# Altium project RC_Transmitter.PrjPcb
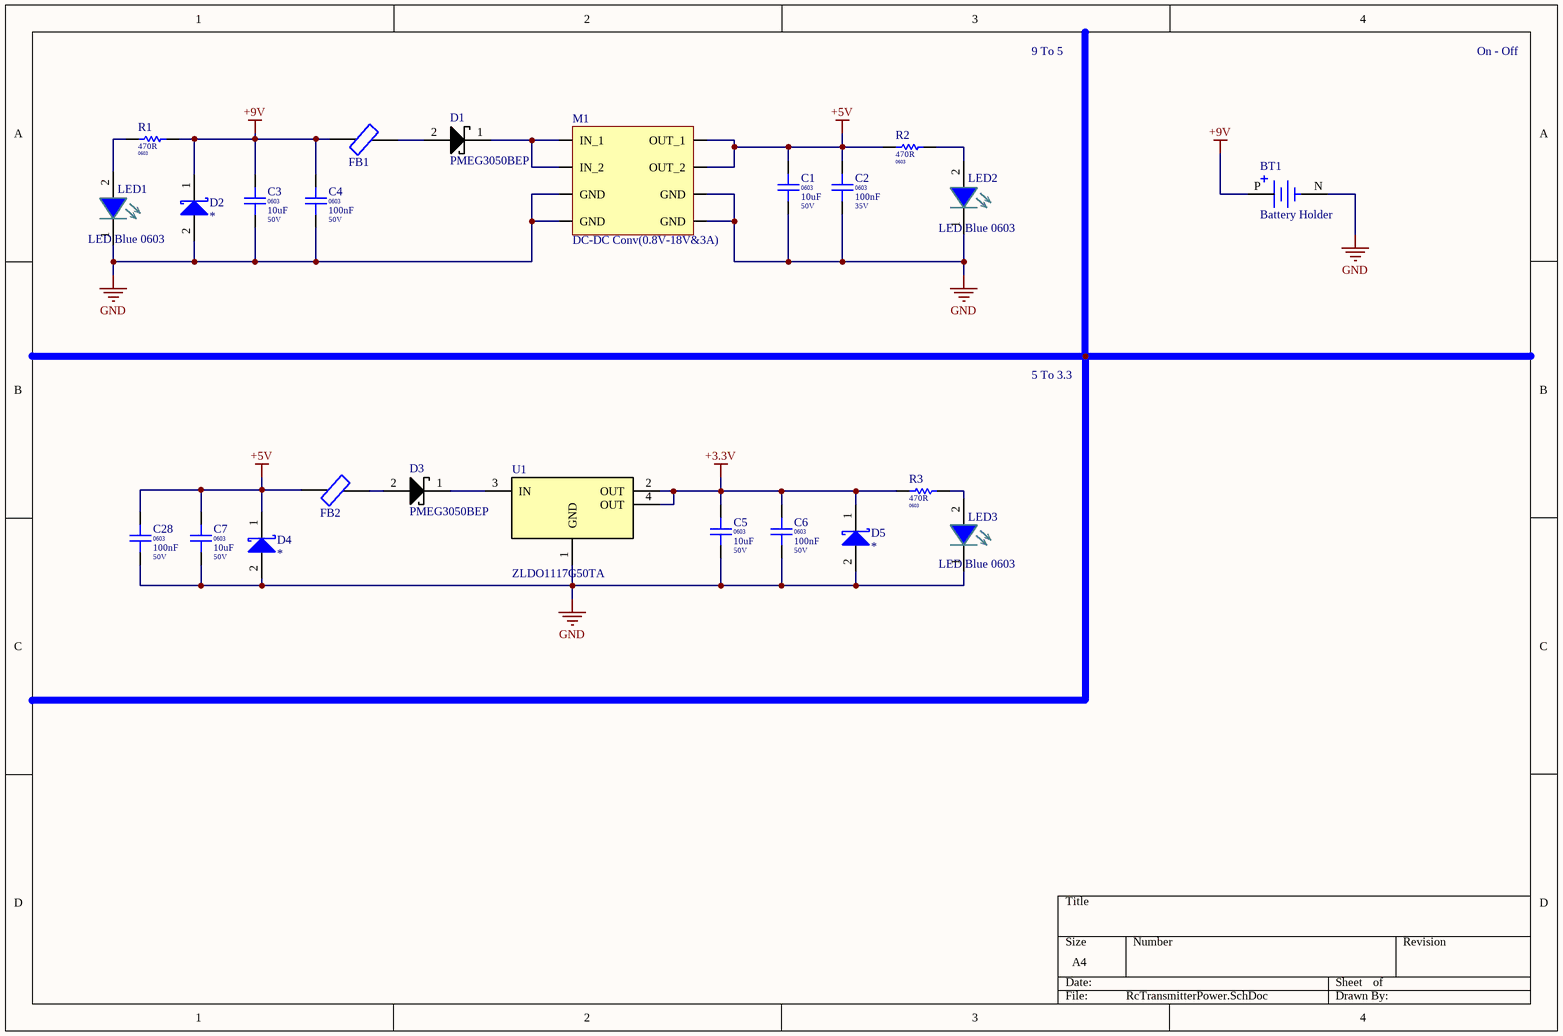
[diagram p0: RcTransmitterPower.SchDoc]
3 sheets, 99 parts. Net scope: flat (ports and power ports of the same name join across sheets).
Board file: RcTransmitter.PcbDoc
Sheets:
  RcTransmitterPower.SchDoc
  RcTransmitterMC.SchDoc
  RcTransmitterSwitches.SchDoc

## Sheet RcTransmitterPower.SchDoc
size A4; SheetNumber: 1; SheetTotal: 3

### Parts
BT1  Battery Holder  [BAT_BC9VPC]
C1  Package / Case: 0603  Voltage: 50V  [CAPC 0603]  (hidden comment: 10uF)
C2  Package / Case: 0603  Voltage: 35V  [CAPC 0603]  (hidden comment: 100nF)
C3  Package / Case: 0603  Voltage: 50V  [CAPC 0603]  (hidden comment: 10uF)
C4  Package / Case: 0603  Voltage: 50V  [CAPC 0603]  (hidden comment: 100nF)
C5  Package / Case: 0603  Voltage: 50V  [CAPC 0603]  (hidden comment: 10uF)
C6  Package / Case: 0603  Voltage: 50V  [CAPC 0603]  (hidden comment: 100nF)
C7  Package / Case: 0603  Voltage: 50V  [CAPC 0603]  (hidden comment: 10uF)
C28  Package / Case: 0603  Voltage: 50V  [CAPC 0603]  (hidden comment: 100nF)
D1  PMEG3050BEP  [SOD470X100-2N]
D2  *  [DO-214AC, SMA]
D3  PMEG3050BEP  [SOD470X100-2N]
D4  *  [DO-214AC, SMA]
D5  *  [DO-214AC, SMA]
FB1  Ferrite Bead  [FCM1608KF-601T03]  (value not drawn)
FB2  Ferrite Bead  [FCM1608KF-601T03]  (value not drawn)
LED1  LED Blue 0603  [LED BLUE 0603]
LED2  LED Blue 0603  [LED BLUE 0603]
LED3  LED Blue 0603  [LED BLUE 0603]
M1  DC-DC Conv(0.8V-18V&3A)  [mp]
R1  Package / Case: 0603  [RESC 0603]  (hidden comment: 470R)
R2  Package / Case: 0603  [RESC 0603]  (hidden comment: 470R)
R3  Package / Case: 0603  [RESC 0603]  (hidden comment: 470R)
U1  ZLDO1117G50TA  [1117]

### Nets
+3.3V: C5.2 C6.2 D5.1(K) R3.2 U1.2(OUT) U1.4(OUT)
+5V: C1.2 C2.2 C7.2 C28.2 D4.1(K) FB2.1 M1.3(OUT_1) M1.4(OUT_2) R2.2
+9V: BT1.P(POS) C3.2 C4.2 D2.1(K) FB1.1 R1.1
GND: BT1.N(NEG) C1.1 C2.1 C3.1 C4.1 C5.1 C6.1 C7.1 C28.1 D2.2(A) D4.2(A) D5.2(A) LED1.1 LED2.1 LED3.1 M1.5(GND) M1.6(GND) M1.7(GND) M1.8(GND) U1.1(GND)
NetD1_1: D1.1(K) M1.1(IN_1) M1.2(IN_2)
NetD1_2: D1.2(A) FB1.2
NetD3_1: D3.1(K) U1.3(IN)
NetD3_2: D3.2(A) FB2.2
NetLED1_2: LED1.2 R1.2
NetLED2_2: LED2.2 R2.1
NetLED3_2: LED3.2 R3.1

### Notes on the sheet
- 9 To 5
- On - Off
- 5 To 3.3

### Library data of the parts
BT1 = Battery Holder: BATTERY HOLDER 9V PC PIN; MF: MPD; MP: BC9VPC; Check_prices: https://www.snapeda.com/parts/BC9VPC/MPD/view-part/4389071/?ref=eda; Package: None; Value: *; Price: None; Availability: Warning; SnapEDA_Link: https://www.snapeda.com/parts/BC9VPC/MPD/view-part/4389071/?ref=snap; Purchase-URL: https://pricing.snapeda.com/search/part/BC9VPC/?ref=eda
C1 C3 C5 C7 = CAPC0301: Capacitor Ceramic 10uF 50V 0603; Tolerance: %10; Value Rating: uF; Value: 10uF; Part Number: CAPC0301; Category: Capacitor Ceramic; Values: 10uF 50V
C2 = CAPC0328: Capacitor Ceramic 100nF 35V 0603; Tolerance: %10; Value Rating: nF; Value: 100nF; Part Number: CAPC0328; Category: Capacitor Ceramic; Values: 100nF 35V
C4 C6 C28 = CAPC0285: Capacitor Ceramic 100nF 50V 0603; Tolerance: %10; Value Rating: nF; Favorites: Favorite; Value: 100nF; Part Number: CAPC0285; Category: Capacitor Ceramic; Values: 100nF 50V
D1 D3 = Schotky Diode: Manufacturer: Nexperia USA; Manufacturer Part Number: PMEG3050BEP,115; Supplier 1: Digi-Key; Supplier Part Number 1: 1727-5207-1-ND; Stock 1: 62590; Pricing 1: 1=0.44, 10=0.373, 100=0.2786, 500=0.2189, 1000=0.1692 (USD)
D2 D4 D5 = Diode0012: Values: FILL!!!; Diode Type: Schottky; Manufacturer Part Number: *; Part Number: Diode0012; Category: Diode Schottky; Package / Case: DO-214AC, SMA; Voltage - DC Reverse (Vr): FILL!!!; Voltage - Forward (Vf): FILL!!!; Current: FILL!!!; Speed: FILL!!!
FB1 FB2 = FCM1608KF-601T03
M1 = MP1584EN
R1-R3 = R0188: 470R 0603; Part Number: R0188; Tolerance: %5; Power: 1/10W; Value: 470R; Category: Resistor; Values: 470R
U1 = ZLDO1117G50TA: IC REG LDO 5V 1A SOT223

## Sheet RcTransmitterMC.SchDoc
size 297 x 203 mm; SheetNumber: 2; SheetTotal: 3
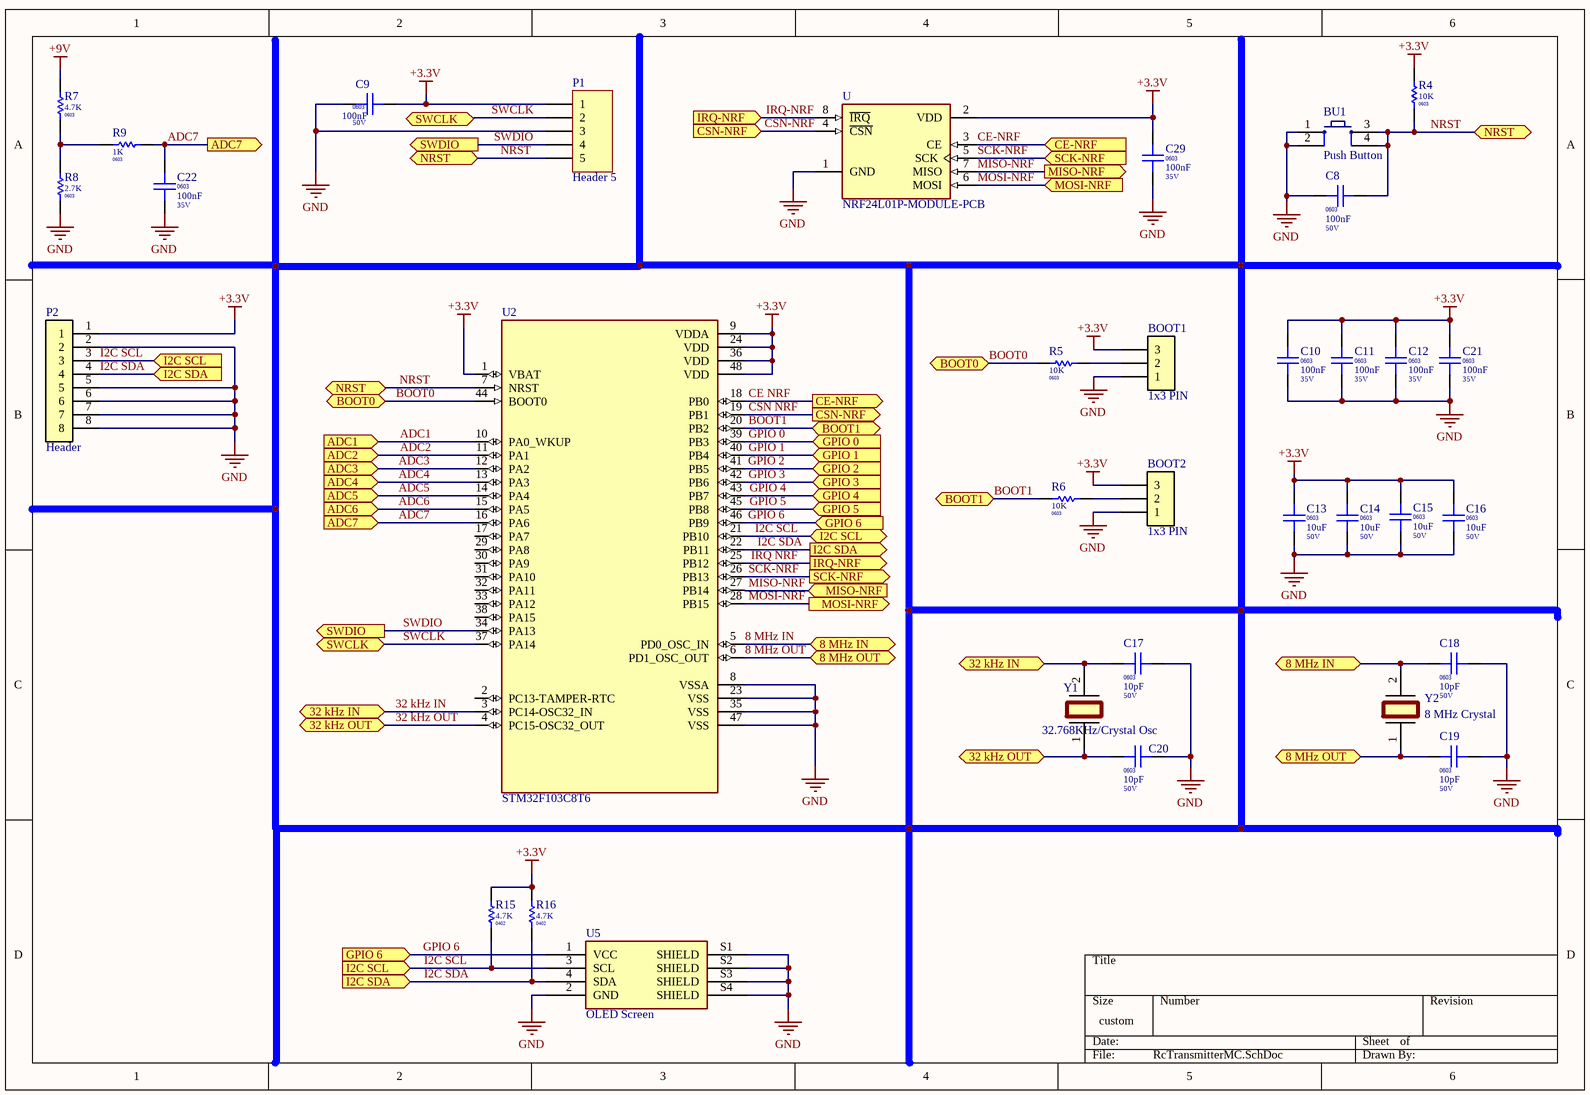
[diagram p1: RcTransmitterMC.SchDoc]

### Parts
BOOT1  1x3 PIN  [HDR_2.54_1X3]
BOOT2  1x3 PIN  [HDR_2.54_1X3]
BU1  Push Button  [button son]
C8  Package / Case: 0603  Voltage: 50V  [CAPC 0603]  (hidden comment: 100nF)
C9  Package / Case: 0603  Voltage: 50V  [CAPC 0603]  (hidden comment: 100nF)
C10  Package / Case: 0603  Voltage: 35V  [CAPC 0603]  (hidden comment: 100nF)
C11  Package / Case: 0603  Voltage: 35V  [CAPC 0603]  (hidden comment: 100nF)
C12  Package / Case: 0603  Voltage: 35V  [CAPC 0603]  (hidden comment: 100nF)
C13  Package / Case: 0603  Voltage: 50V  [CAPC 0603]  (hidden comment: 10uF)
C14  Package / Case: 0603  Voltage: 50V  [CAPC 0603]  (hidden comment: 10uF)
C15  Package / Case: 0603  Voltage: 50V  [CAPC 0603]  (hidden comment: 10uF)
C16  Package / Case: 0603  Voltage: 50V  [CAPC 0603]  (hidden comment: 10uF)
C17  Package / Case: 0603  Voltage: 50V  [CAPC 0603]  (hidden comment: 10pF)
C18  Package / Case: 0603  Voltage: 50V  [CAPC 0603]  (hidden comment: 10pF)
C19  Package / Case: 0603  Voltage: 50V  [CAPC 0603]  (hidden comment: 10pF)
C20  Package / Case: 0603  Voltage: 50V  [CAPC 0603]  (hidden comment: 10pF)
C21  Package / Case: 0603  Voltage: 35V  [CAPC 0603]  (hidden comment: 100nF)
C22  Package / Case: 0603  Voltage: 35V  [CAPC 0603]  (hidden comment: 100nF)
C29  Package / Case: 0603  Voltage: 35V  [CAPC 0603]  (hidden comment: 100nF)
P1  Header 5  [HDR1X5]
P2  Header  [IMU_HEADER]
R4  Package / Case: 0603  [RESC 0603]  (hidden comment: 10K)
R5  Package / Case: 0603  [RESC 0603]  (hidden comment: 10K)
R6  Package / Case: 0603  [RESC 0603]  (hidden comment: 10K)
R7  Package / Case: 0603  [RESC 0603]  (hidden comment: 4.7K)
R8  Package / Case: 0603  [RESC 0603]  (hidden comment: 2.7K)
R9  Package / Case: 0603  [RESC 0603]  (hidden comment: 1K)
R15  Package / Case: 0402  [RESC 0402]  (hidden comment: 4.7K)
R16  Package / Case: 0402  [RESC 0402]  (hidden comment: 4.7K)
U  NRF24L01P-MODULE-PCB  [nrf]
U2  STM32F103C8T6  [QFP50P900X900X160-48N]
U5  OLED Screen  [SSD1106 OLED]
Y1  32.768KHz/Crystal Osc  [32KhZ crystal oscillator]
Y2  8 MHz Crystal  [XTAL_HC49P488W43L1085T450H368]

### Ports
8 MHz IN (bidir), 8 MHz OUT (bidir), 32 kHz IN (bidir), 32 kHz OUT (bidir), ADC1 (in), ADC2 (in), ADC3 (in), ADC4 (in), ADC5 (in), ADC6 (in), ADC7 (in), ADC7 (out), BOOT0 (bidir), BOOT1 (bidir), CE-NRF (in), CE-NRF (out), CSN-NRF (in), CSN-NRF (out), GPIO 0 (in), GPIO 1 (in), GPIO 2 (in), GPIO 3 (in), GPIO 4 (in), GPIO 5 (in), GPIO 6 (in), I2C SCL (bidir), I2C SCL (in), I2C SDA (in), I2C SDA (out), IRQ-NRF (in), IRQ-NRF (out), MISO-NRF (in), MISO-NRF (out), MOSI-NRF (in), MOSI-NRF (out), NRST (bidir), SCK-NRF (in), SCK-NRF (out), SWCLK (bidir), SWDIO (out)

### Nets
+3.3V: BOOT1.3 BOOT2.3 C9.2 C10.2 C11.2 C12.2 C13.2 C14.2 C15.2 C16.2 C21.2 C29.2 P1.1 P2.1 R4.2 R15.2 R16.2 U.2(VDD) U2.1(VBAT) U2.9(VDDA) U2.24(VDD) U2.36(VDD) U2.48(VDD)
+9V: R7.2
GND: BOOT1.1 BOOT2.1 BU1.1 BU1.2 C8.1 C9.1 C10.1 C11.1 C12.1 C13.1 C14.1 C15.1 C16.1 C17.2 C18.2 C19.2 C20.2 C21.1 C22.1 C29.1 P1.3 P2.2 P2.5 P2.6 P2.7 P2.8 R8.1 U.1(GND) U2.8(VSSA) U2.23(VSS) U2.35(VSS) U2.47(VSS) U5.2(GND) U5.S1(SHIELD) U5.S2(SHIELD) U5.S3(SHIELD) U5.S4(SHIELD)
8 MHz IN: C18.1 U2.5(PD0_OSC_IN) Y2.2 ; port 8 MHz IN
8 MHz OUT: C19.1 U2.6(PD1_OSC_OUT) Y2.1 ; port 8 MHz OUT
32 kHz IN: C17.1 U2.3(PC14-OSC32_IN) Y1.2 ; port 32 kHz IN
32 kHz OUT: C20.1 U2.4(PC15-OSC32_OUT) Y1.1 ; port 32 kHz OUT
ADC1: U2.10(PA0_WKUP) ; port ADC1
ADC2: U2.11(PA1) ; port ADC2
ADC3: U2.12(PA2) ; port ADC3
ADC4: U2.13(PA3) ; port ADC4
ADC5: U2.14(PA4) ; port ADC5
ADC6: U2.15(PA5) ; port ADC6
ADC7: C22.2 R9.2 U2.16(PA6) ; port ADC7
BOOT0: R5.1 U2.44(BOOT0) ; port BOOT0
BOOT1: R6.1 U2.20(PB2) ; port BOOT1
CE NRF: U.3(CE) U2.18(PB0) ; port CE-NRF  [also labelled CE-NRF]
CSN NRF: U.4(~{CSN}) U2.19(PB1) ; port CSN-NRF  [also labelled CSN-NRF]
GPIO 0: U2.39(PB3) ; port GPIO 0
GPIO 1: U2.40(PB4) ; port GPIO 1
GPIO 2: U2.41(PB5) ; port GPIO 2
GPIO 3: U2.42(PB6) ; port GPIO 3
GPIO 4: U2.43(PB7) ; port GPIO 4
GPIO 5: U2.45(PB8) ; port GPIO 5
GPIO 6: U2.46(PB9) U5.1(VCC) ; port GPIO 6
I2C SCL: P2.3 R15.1 U2.21(PB10) U5.3(SCL) ; port I2C SCL
I2C SDA: P2.4 R16.1 U2.22(PB11) U5.4(SDA) ; port I2C SDA
IRQ NRF: U.8(~{IRQ}) U2.25(PB12) ; port IRQ-NRF  [also labelled IRQ-NRF]
MISO-NRF: U.7(MISO) U2.27(PB14) ; port MISO-NRF
MOSI-NRF: U.6(MOSI) U2.28(PB15) ; port MOSI-NRF
NRST: BU1.3 BU1.4 C8.2 P1.5 R4.1 U2.7(NRST) ; port NRST
SCK-NRF: U.5(SCK) U2.26(PB13) ; port SCK-NRF
SWCLK: P1.2 U2.37(PA14) ; port SWCLK
SWDIO: P1.4 U2.34(PA13) ; port SWDIO
NetBOOT1_2: BOOT1.2 R5.2
NetBOOT2_2: BOOT2.2 R6.2
NetR7_1: R7.1 R8.2 R9.1

Not connected (* = marked no-connect by the designer): U2 2(PC13-TAMPER-RTC) 17(PA7) 29(PA8) 30(PA9) 31(PA10) 32(PA11) 33(PA12) 38(PA15)

### Library data of the parts
BOOT1 BOOT2 = Connector0009: Header 2.54 1x3; Part Number: Connector0009; Category: Connectors; Package / Case: HDR_2.54_1X3; Values: Header 2.54 1x3
BU1 = Push Button: Smd Push Button; Satın Alma Linki: https://urun.n11.com/diger/mini-pushbutton-switch-smd-P227461537?gclid=Cj0KCQjwkoDmBRCcARIsAG3xzl8Y_-jeD7HocNM6lvuZ_rVp83568XPGtNzlPwXWLph8oCRqo0yh87UaApZYEALw_wcB&gclsrc=aw.ds
C8 C9 = CAPC0285: as C4 on sheet RcTransmitterPower; Value: 100nF; Part Number: CAPC0285; Category: Capacitor Ceramic; Values: 100nF 50V
C10-C12 C21 C22 C29 = CAPC0328: as C2 on sheet RcTransmitterPower; Value: 100nF; Part Number: CAPC0328; Category: Capacitor Ceramic; Values: 100nF 35V
C13-C16 = CAPC0301: as C1 on sheet RcTransmitterPower; Value: 10uF; Part Number: CAPC0301; Category: Capacitor Ceramic; Values: 10uF 50V
C17-C20 = CAPC0242: Capacitor Ceramic 10pF 50V 0603; Tolerance: %10; Value Rating: pF; Value: 10pF; Part Number: CAPC0242; Category: Capacitor Ceramic; Values: 10pF 50V
P1 = Header 5: Header, 5-Pin; LatestRevisionDate: 17-Jul-2002; LatestRevisionNote: Re-released for DXP Platform.; Publisher: Altium Limited
P2 = IMU_HEADER: 1x8
R4-R6 = R0220: 10K 0603; Part Number: R0220; Tolerance: %5; Power: 1/10W; Value: 10K; Category: Resistor; Values: 10K
R7 = R0212: 4.7K 0603; Part Number: R0212; Tolerance: %5; Power: 1/10W; Value: 4.7K; Category: Resistor; Values: 4.7K
R8 = R0206: 2.7K 0603; Part Number: R0206; Tolerance: %5; Power: 1/10W; Value: 2.7K; Category: Resistor; Values: 2.7K
R9 = R0196: 1K 0603; Part Number: R0196; Tolerance: %5; Power: 1/10W; Value: 1K; Category: Resistor; Values: 1K
R15 R16 = R0066: 4.7K 0402; Part Number: R0066; Tolerance: %5; Power: 1/10W; Value: 4.7K; Category: Resistor; Values: 4.7K
U = NRF24L01P-MODULE-PCB: - Transceiver For Use With nRF24L01+; MF: Nordic Semiconductor; Package: None; MP: NRF24L01P-MODULE-PCB; Value: *; Availability: Bad; Price: None; SnapEDA_Link: https://www.snapeda.com/parts/NRF24L01P-MODULE-PCB/Nordic%20Semiconductor%20ASA/view-part/230534/?ref=snap; Mouser-Purchase-URL: https://snapeda.com/shop?store=Mouser&id=230534
U2 = STM32F103C8T6: ARMÂ® CortexÂ®-M3 STM32F1 Microcontroller IC 32-Bit 72MHz 64KB _64K x 8_ FLASH; MF: STMicroelectronics; Price: None; Package: LQFP-48 STMicroelectronics; Value: *; MP: STM32F103C8T6; Availability: Unavailable; SnapEDA_Link: https://www.snapeda.com/parts/STM32F103C8T6/STMicroelectronics/view-part/52195/?ref=snap
U5 = SSD1106 OLED
Y1 = NX3215SA-32.768KHZ-EXS00A-MU00525: Crystal or Oscillator; ComponentLink1Description: New link; ComponentLink1URL: *
Y2 = XTAL_HC49P488W43L1085T450H368

## Sheet RcTransmitterSwitches.SchDoc
size A4; SheetNumber: 3; SheetTotal: 3
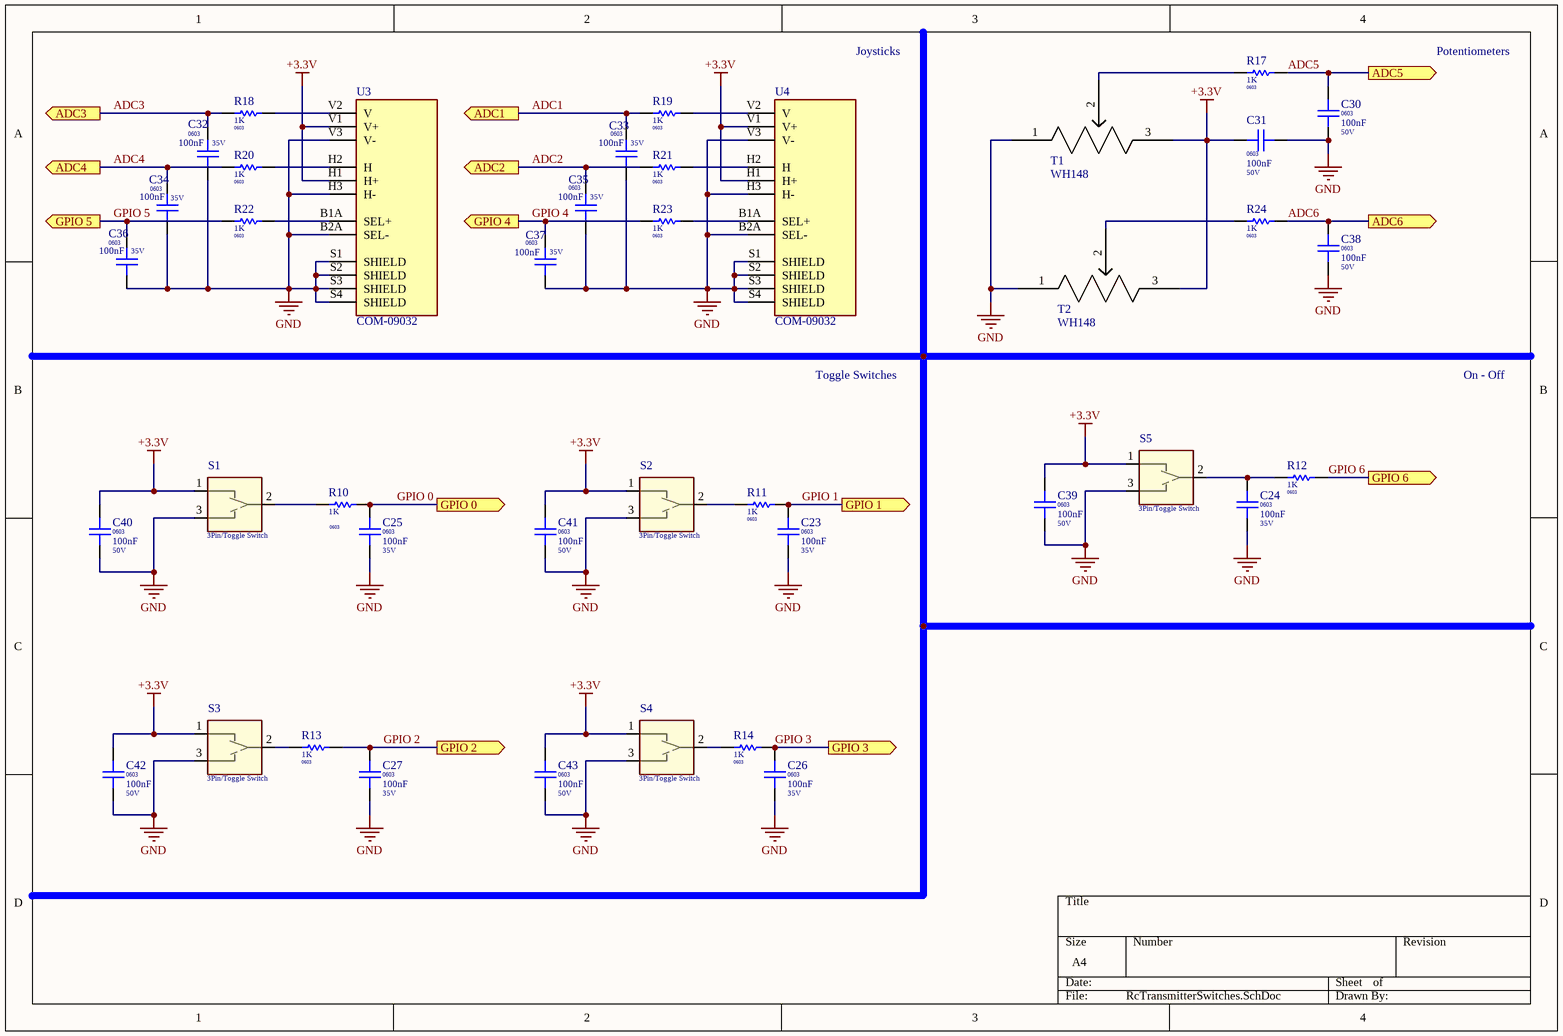
[diagram p2: RcTransmitterSwitches.SchDoc]

### Parts
C23  Package / Case: 0603  Voltage: 35V  [CAPC 0603]  (hidden comment: 100nF)
C24  Package / Case: 0603  Voltage: 35V  [CAPC 0603]  (hidden comment: 100nF)
C25  Package / Case: 0603  Voltage: 35V  [CAPC 0603]  (hidden comment: 100nF)
C26  Package / Case: 0603  Voltage: 35V  [CAPC 0603]  (hidden comment: 100nF)
C27  Package / Case: 0603  Voltage: 35V  [CAPC 0603]  (hidden comment: 100nF)
C30  Package / Case: 0603  Voltage: 50V  [CAPC 0603]  (hidden comment: 100nF)
C31  Package / Case: 0603  Voltage: 50V  [CAPC 0603]  (hidden comment: 100nF)
C32  Package / Case: 0603  Voltage: 35V  [CAPC 0603]  (hidden comment: 100nF)
C33  Package / Case: 0603  Voltage: 35V  [CAPC 0603]  (hidden comment: 100nF)
C34  Package / Case: 0603  Voltage: 35V  [CAPC 0603]  (hidden comment: 100nF)
C35  Package / Case: 0603  Voltage: 35V  [CAPC 0603]  (hidden comment: 100nF)
C36  Package / Case: 0603  Voltage: 35V  [CAPC 0603]  (hidden comment: 100nF)
C37  Package / Case: 0603  Voltage: 35V  [CAPC 0603]  (hidden comment: 100nF)
C38  Package / Case: 0603  Voltage: 50V  [CAPC 0603]  (hidden comment: 100nF)
C39  Package / Case: 0603  Voltage: 50V  [CAPC 0603]  (hidden comment: 100nF)
C40  Package / Case: 0603  Voltage: 50V  [CAPC 0603]  (hidden comment: 100nF)
C41  Package / Case: 0603  Voltage: 50V  [CAPC 0603]  (hidden comment: 100nF)
C42  Package / Case: 0603  Voltage: 50V  [CAPC 0603]  (hidden comment: 100nF)
C43  Package / Case: 0603  Voltage: 50V  [CAPC 0603]  (hidden comment: 100nF)
R10  Package / Case: 0603  [RESC 0603]  (hidden comment: 1K)
R11  Package / Case: 0603  [RESC 0603]  (hidden comment: 1K)
R12  Package / Case: 0603  [RESC 0603]  (hidden comment: 1K)
R13  Package / Case: 0603  [RESC 0603]  (hidden comment: 1K)
R14  Package / Case: 0603  [RESC 0603]  (hidden comment: 1K)
R17  Package / Case: 0603  [RESC 0603]  (hidden comment: 1K)
R18  Package / Case: 0603  [RESC 0603]  (hidden comment: 1K)
R19  Package / Case: 0603  [RESC 0603]  (hidden comment: 1K)
R20  Package / Case: 0603  [RESC 0603]  (hidden comment: 1K)
R21  Package / Case: 0603  [RESC 0603]  (hidden comment: 1K)
R22  Package / Case: 0603  [RESC 0603]  (hidden comment: 1K)
R23  Package / Case: 0603  [RESC 0603]  (hidden comment: 1K)
R24  Package / Case: 0603  [RESC 0603]  (hidden comment: 1K)
S1  3Pin/Toggle Switch  [3Pin/Toggle Switch]
S2  3Pin/Toggle Switch  [3Pin/Toggle Switch]
S3  3Pin/Toggle Switch  [3Pin/Toggle Switch]
S4  3Pin/Toggle Switch  [3Pin/Toggle Switch]
S5  3Pin/Toggle Switch  [3Pin/Toggle Switch]
T1  WH148  [WH148]
T2  WH148  [WH148]
U3  COM-09032  [XDCR_COM-09032]
U4  COM-09032  [XDCR_COM-09032]

### Ports
ADC1 (out), ADC2 (out), ADC3 (out), ADC4 (out), ADC5 (out), ADC6 (out), GPIO 0 (out), GPIO 1 (out), GPIO 2 (out), GPIO 3 (out), GPIO 4 (out), GPIO 5 (out), GPIO 6 (out)

### Nets
+3.3V: C31.2 C39.2 C40.2 C41.2 C42.2 C43.2 S1.1 S2.1 S3.1 S4.1 S5.1 T1.3 T2.3 U3.H1(H+) U3.V1(V+) U4.H1(H+) U4.V1(V+)
GND: C23.1 C24.1 C25.1 C26.1 C27.1 C30.2 C31.1 C32.1 C33.1 C34.1 C35.1 C36.1 C37.1 C38.2 C39.1 C40.1 C41.1 C42.1 C43.1 S1.3 S2.3 S3.3 S4.3 S5.3 T1.1 T2.1 U3.B2A(SEL-) U3.H3(H-) U3.S1(SHIELD) U3.S2(SHIELD) U3.S3(SHIELD) U3.S4(SHIELD) U3.V3(V-) U4.B2A(SEL-) U4.H3(H-) U4.S1(SHIELD) U4.S2(SHIELD) U4.S3(SHIELD) U4.S4(SHIELD) U4.V3(V-)
ADC1: C33.2 R19.1 ; port ADC1
ADC2: C35.2 R21.1 ; port ADC2
ADC3: C32.2 R18.1 ; port ADC3
ADC4: C34.2 R20.1 ; port ADC4
ADC5: C30.1 R17.2 ; port ADC5
ADC6: C38.1 R24.2 ; port ADC6
GPIO 0: C25.2 R10.2 ; port GPIO 0
GPIO 1: C23.2 R11.2 ; port GPIO 1
GPIO 2: C27.2 R13.2 ; port GPIO 2
GPIO 3: C26.2 R14.1 ; port GPIO 3
GPIO 4: C37.2 R23.1 ; port GPIO 4
GPIO 5: C36.2 R22.1 ; port GPIO 5
GPIO 6: R12.2 ; port GPIO 6
NetC24_2: C24.2 R12.1 S5.2
NetR10_1: R10.1 S1.2
NetR11_1: R11.1 S2.2
NetR13_1: R13.1 S3.2
NetR14_2: R14.2 S4.2
NetR17_1: R17.1 T1.2
NetR18_2: R18.2 U3.V2(V)
NetR19_2: R19.2 U4.V2(V)
NetR20_2: R20.2 U3.H2(H)
NetR21_2: R21.2 U4.H2(H)
NetR22_2: R22.2 U3.B1A(SEL+)
NetR23_2: R23.2 U4.B1A(SEL+)
NetR24_1: R24.1 T2.2

### Notes on the sheet
- Joysticks
- Potentiometers
- Toggle Switches
- On - Off

### Library data of the parts
C23-C27 C32-C37 = CAPC0328: as C2 on sheet RcTransmitterPower; Value: 100nF; Part Number: CAPC0328; Category: Capacitor Ceramic; Values: 100nF 35V
C30 C31 C38-C43 = CAPC0285: as C4 on sheet RcTransmitterPower; Value: 100nF; Part Number: CAPC0285; Category: Capacitor Ceramic; Values: 100nF 50V
R10-R14 R17-R24 = R0196: as R9 on sheet RcTransmitterMC; Value: 1K; Category: Resistor; Values: 1K
S1-S5 = 4-1825136-5: Switch Toggle ON None ON SPDT Long Baton Lever PC Pins 5A 250VAC 28VDC PC Mount with Threads Bulk; MF: TE Connectivity; SnapEDA_Link: https://www.snapeda.com/parts/4-1825136-5/TE%20Connectivity%20ALCOSWITCH%20Switches/view-part/?ref=snap; Price: None; TE_purchase_URL: https://www.te.com/usa-en/product-4-1825136-5.html?te_bu=Cor&te_type=disp&te_campaign=seda_glo_cor-seda-global-disp-prtnr-fy19-seda-model-bom-cta_sma-317_1&elqCampaignId=32493; EU_RoHS_Compliance: Compliant with Exemptions; Package: SOIC-8 TE Connectivity; Availability: Unavailable; MP: 4-1825136-5; Value: *; Supplier 1: Digi-Key; Supplier Part Number 1: 450-1784-ND; Name: 3Pin/Toggle Switch
U3 U4 = COM-09032: Joystick, 2 - Axis Analog _Resistive_ Output; MF: SparkFun Electronics; SnapEDA_Link: https://www.snapeda.com/parts/COM-09032/SparkFun%20Electronics/view-part/888157/?ref=snap; Availability: Unavailable; Value: *; Price: None; MP: COM-09032; Package: SparkFun Electronics

## Nets that join several sheets
+3.3V: RcTransmitterPower (6 pins), RcTransmitterMC (23 pins), RcTransmitterSwitches (17 pins)
+9V: RcTransmitterPower (6 pins), RcTransmitterMC (R7.2)
GND: RcTransmitterPower (20 pins), RcTransmitterMC (37 pins), RcTransmitterSwitches (40 pins)
ADC1: RcTransmitterMC (U2.10), RcTransmitterSwitches (C33.2 R19.1)
ADC2: RcTransmitterMC (U2.11), RcTransmitterSwitches (C35.2 R21.1)
ADC3: RcTransmitterMC (U2.12), RcTransmitterSwitches (C32.2 R18.1)
ADC4: RcTransmitterMC (U2.13), RcTransmitterSwitches (C34.2 R20.1)
ADC5: RcTransmitterMC (U2.14), RcTransmitterSwitches (C30.1 R17.2)
ADC6: RcTransmitterMC (U2.15), RcTransmitterSwitches (C38.1 R24.2)
GPIO 0: RcTransmitterMC (U2.39), RcTransmitterSwitches (C25.2 R10.2)
GPIO 1: RcTransmitterMC (U2.40), RcTransmitterSwitches (C23.2 R11.2)
GPIO 2: RcTransmitterMC (U2.41), RcTransmitterSwitches (C27.2 R13.2)
GPIO 3: RcTransmitterMC (U2.42), RcTransmitterSwitches (C26.2 R14.1)
GPIO 4: RcTransmitterMC (U2.43), RcTransmitterSwitches (C37.2 R23.1)
GPIO 5: RcTransmitterMC (U2.45), RcTransmitterSwitches (C36.2 R22.1)
GPIO 6: RcTransmitterMC (U2.46 U5.1), RcTransmitterSwitches (R12.2)